# EAGLE design RevisedCape (EAGLE 7.2.0)
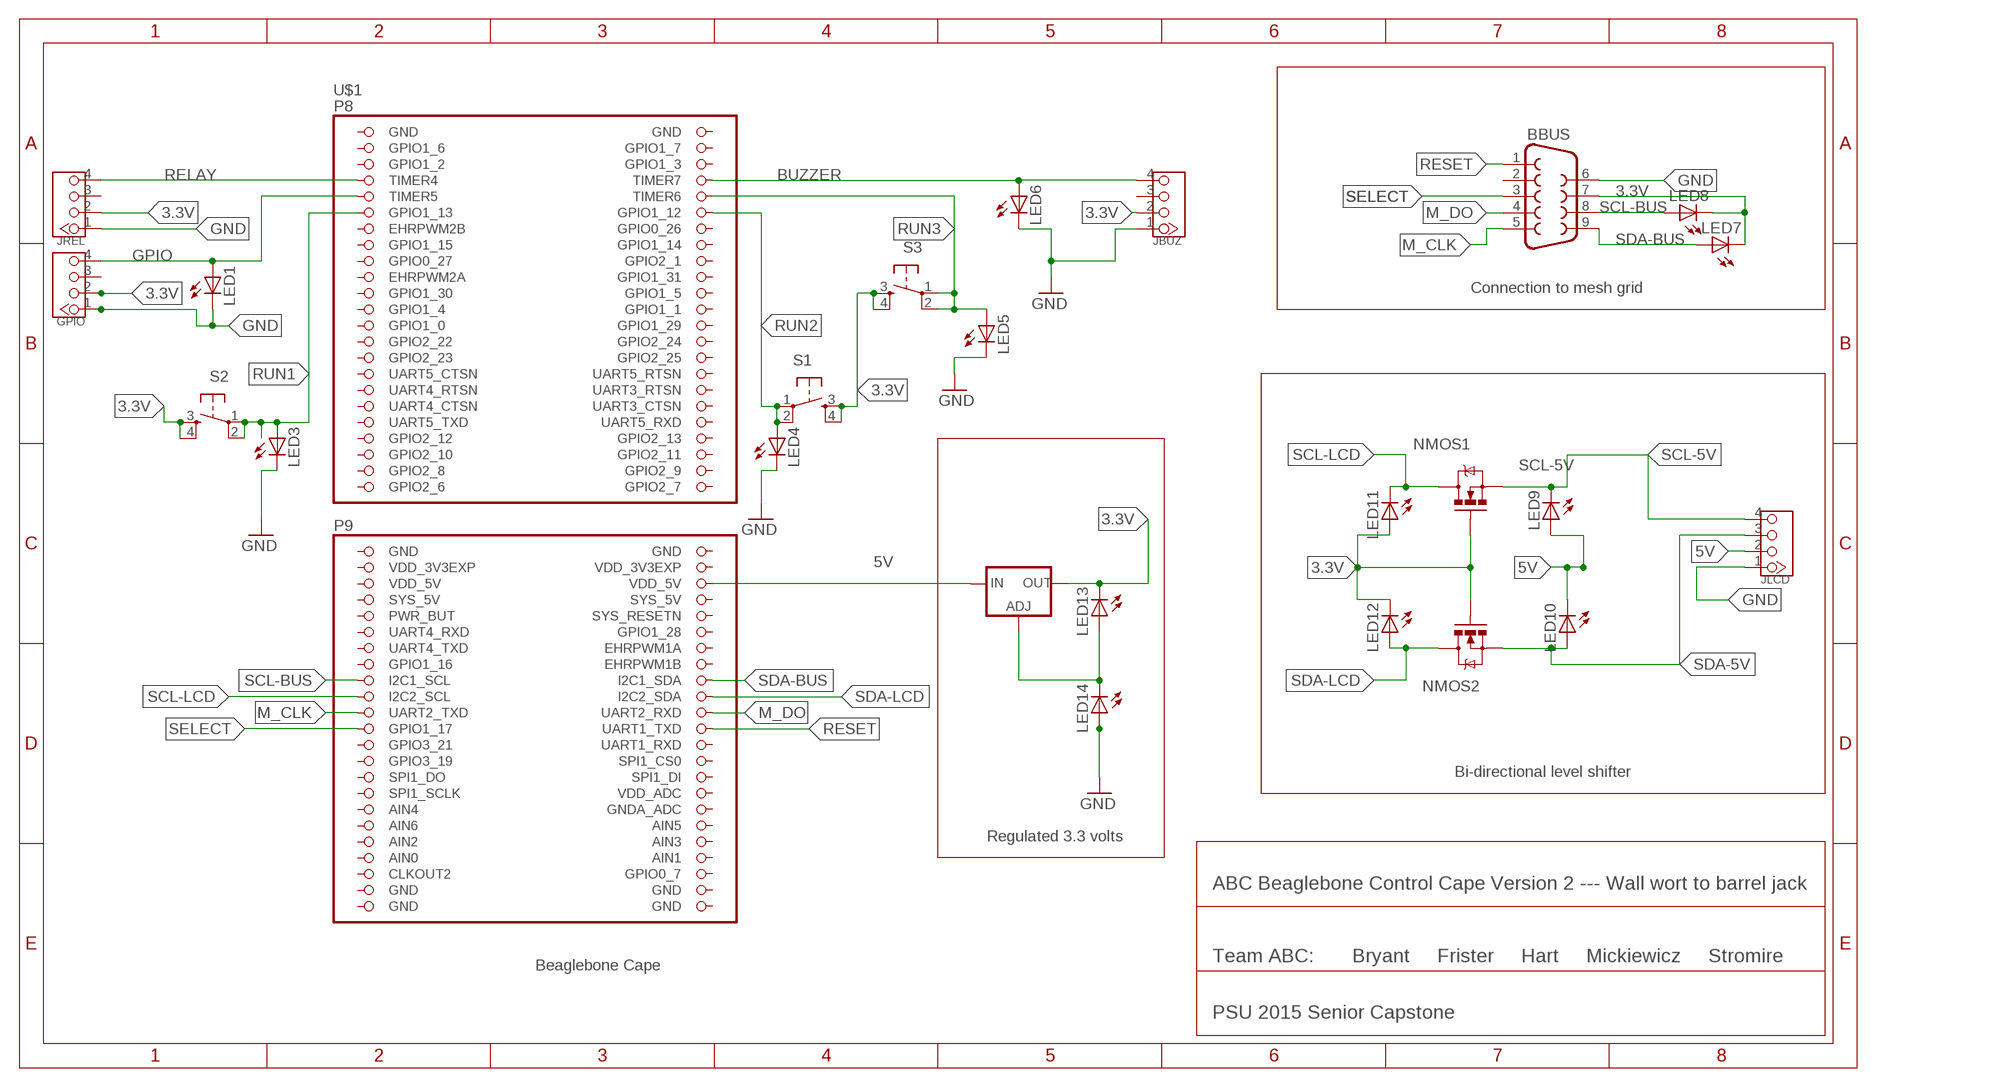
[diagram p0: schematic, sheet 1]

## Parts
3.3VREG  V_REG_317SINK  [TO220-ADJ]
BBUS  F09H  [F09H]
GPIO  TWIG-4P-2.0-2.0  [4P-2.0]
JBUZ  TWIG-4P-2.0-2.0  [4P-2.0]
JLCD  TWIG-4P-2.0-2.0  [4P-2.0]
JREL  TWIG-4P-2.0-2.0  [4P-2.0]
LED1  LED3MM  [LED3MM]
LED3  LED3MM  [LED3MM]
LED4  LED3MM  [LED3MM]
LED5  LED3MM  [LED3MM]
LED6  LED3MM  [LED3MM]
LED7  LED3MM  [LED3MM]
LED8  LED3MM  [LED3MM]
LED9  LED3MM  [LED3MM]
LED10  LED3MM  [LED3MM]
LED11  LED3MM  [LED3MM]
LED12  LED3MM  [LED3MM]
LED13  LED3MM  [LED3MM]
LED14  LED3MM  [LED3MM]
NMOS1  MOSFET-NCHANNEL2N7000  [TO-92]
NMOS2  MOSFET-NCHANNEL2N7000  [TO-92]
S1  TAC_SWITCHPTH  [TACTILE-PTH]
S2  TAC_SWITCHPTH  [TACTILE-PTH]
S3  TAC_SWITCHPTH  [TACTILE-PTH]
U$1  BEAGLEBONE_OUTLINE  [BEAGLEBONE_SHIELD]

## Nets
3.3V: 3.3VREG.OUT BBUS.7 GPIO.2 JBUZ.2 JREL.2 LED7.K(C) LED8.K(C) LED11.A LED12.K(C) LED13.K(C) NMOS1.2(G) NMOS2.2(G) S1.3 S1.4 S2.3 S2.4 S3.3 S3.4
5V: 3.3VREG.IN JLCD.2 LED9.A LED10.K(C) U$1.52(VDD_5V)
BUZZER: JBUZ.4 LED6.A U$1.8(TIMER7)
GND: BBUS.6 GPIO.1 JBUZ.1 JLCD.1 JREL.1 LED1.K(C) LED3.K(C) LED4.K(C) LED5.K(C) LED6.K(C) LED14.A
GPIO: GPIO.4 LED1.A U$1.9(TIMER5)
M_CLK: BBUS.5 U$1.67(UART2_TXD)
M_DO: BBUS.4 U$1.68(UART2_RXD)
REGADJ: 3.3VREG.ADJ LED13.A LED14.K(C)
RELAY: JREL.4 U$1.7(TIMER4)
RESET: BBUS.1 U$1.70(UART1_TXD)
RUN1: LED3.A S2.1 S2.2 U$1.11(GPIO1_13)
RUN2: LED4.A S1.1 S1.2 U$1.12(GPIO1_12)
RUN3: LED5.A S3.1 S3.2 U$1.10(TIMER6)
SCL-5V: JLCD.4 LED9.K(C) NMOS1.1(S)
SCL-BUS: BBUS.8 LED8.A U$1.63(I2C1_SCL)
SCL-LCD: LED11.K(C) NMOS1.3(D) U$1.65(I2C2_SCL)
SDA-5V: JLCD.3 LED10.A NMOS2.1(S)
SDA-BUS: BBUS.9 LED7.A U$1.64(I2C1_SDA)
SDA-LCD: LED12.A NMOS2.3(D) U$1.66(I2C2_SDA)
SELECT: BBUS.3 U$1.69(GPIO1_17)
Unconnected: BBUS.2 GPIO.3 JBUZ.3 JREL.3 U$1.3(GPIO1_6) U$1.4(GPIO1_7) U$1.5(GPIO1_2) U$1.6(GPIO1_3) U$1.13(EHRPWM2B) U$1.14(GPIO0_26) U$1.15(GPIO1_15) U$1.16(GPIO1_14) U$1.17(GPIO0_27) U$1.18(GPIO2_1) U$1.19(EHRPWM2A) U$1.20(GPIO1_31) U$1.21(GPIO1_30) U$1.22(GPIO1_5) U$1.23(GPIO1_4) U$1.24(GPIO1_1) U$1.25(GPIO1_0) U$1.26(GPIO1_29) U$1.27(GPIO2_22) U$1.28(GPIO2_24) U$1.29(GPIO2_23) U$1.30(GPIO2_25) U$1.31(UART5_CTSN) U$1.32(UART5_RTSN) U$1.33(UART4_RTSN) U$1.34(UART3_RTSN) U$1.35(UART4_CTSN) U$1.36(UART3_CTSN) U$1.37(UART5_TXD) U$1.38(UART5_RXD) U$1.39(GPIO2_12) U$1.40(GPIO2_13) U$1.41(GPIO2_10) U$1.42(GPIO2_11) U$1.43(GPIO2_8) U$1.44(GPIO2_9) U$1.45(GPIO2_6) U$1.46(GPIO2_7) U$1.54(SYS_5V) U$1.55(PWR_BUT) U$1.56(SYS_RESETN) U$1.57(UART4_RXD) U$1.58(GPIO1_28) U$1.59(UART4_TXD) U$1.60(EHRPWM1A) U$1.61(GPIO1_16) U$1.62(EHRPWM1B) U$1.71(GPIO3_21) U$1.72(UART1_RXD) U$1.73(GPIO3_19) U$1.74(SPI1_CS0) U$1.75(SPI1_DO) U$1.76(SPI1_DI) U$1.77(SPI1_SCLK) U$1.78(VDD_ADC) U$1.79(AIN4) U$1.80(GNDA_ADC) U$1.81(AIN6) U$1.82(AIN5) U$1.83(AIN2) U$1.84(AIN3) U$1.86(AIN1) U$1.87(CLKOUT2) U$1.88(GPIO0_7)

## Notes on the sheet
- Connection to mesh grid
- Bi-directional level shifter
- Regulated 3.3 volts
- ABC Beaglebone Control Cape | Version 2 --- Wall wort to barrel jack
- Team ABC:       Bryant     Frister     Hart     Mickiewicz     Stromire
- Beaglebone Cape
- PSU 2015 Senior Capstone

## Power pins joined to a net without a drawn wire
AIN0: U$1.85(AIN0)
GND: U$1.1(GND) U$1.2(GND) U$1.47(GND) U$1.48(GND) U$1.89(GND) U$1.90(GND) U$1.91(GND) U$1.92(GND)
SYS_5V: U$1.53(SYS_5V)
VDD_3V3EXP: U$1.49(VDD_3V3EXP) U$1.50(VDD_3V3EXP)
VDD_5V: U$1.51(VDD_5V)

## Library data of the parts
3.3VREG = SparkFun-PowerIC:V_REG_317: Voltage Regulator Standard LM317 adjustable voltage regulator. AOI (Adjust Output Input). Google 'LM317 Calculator' for easy to use app to get the two resistor values needed. 240/720 for 5V output. 240/390 for 3.3V output. Spark Fun Electronics SKU : COM-00527
BBUS = con-subd:F09: SUB-D; OC_FARNELL: unknown; OC_NEWARK: unknown
GPIO JBUZ JLCD JREL = Connector:TWIG-4P-2.0
LED1 LED3-LED14 = adafruit:LED: LED OSRAM: - CHIPLED LG R971, LG N971, LY N971, LG Q971, LY Q971, LO R971, LY R971 LH N974, LH R974 LS Q976, LO Q976, LY Q976 LO Q996 - Hyper CHIPLED LW Q18S LB Q993, LB Q99A, LB R99A - SideLED LS A670, LO A670, LY A670, LG A670, LP A670 LB A673, LV A673, LT A673, LW A673 LH A674 LY A675 LS A676, LA A676, LO A676, LY A676, LW A676 LS A679, LY A679, LG A679 - Hyper Micro SIDELED® LS Y876, LA Y876, LO Y876, LY Y876 LT Y87S - SmartLED LW L88C, LW L88S LB L89C, LB L89S, LG L890 LS L89K, LO L89K, LY L89K LS L896, LA L896, LO L896, LY L896 - TOPLED LS T670, LO T670, LY T670, LG T670, LP T670 LSG T670, LSP T670, LSY T670, LOP T670, LYG T670 LG T671, LOG T671, LSG T671 LB T673, LV T673, LT T673, LW T673 LH T674 LS T676, LA T676, LO T676, LY T676, LB T676, LH T676, LSB T676, LW T676 LB T67C, LV T67C, LT T67C, LS T67K, LO T67K, LY T67K, LW E67C LS E67B, LA E67B, LO E67B, LY E67B, LB E67C, LV E67C, LT E67C LW T67C LS T679, LY T679, LG T679 LS T770, LO T770, LY T770, LG T770, LP T770 LB T773, LV T773, LT T773, LW T773 LH T774 LS E675, LA E675, LY E675, LS T675 LS T776, LA T776, LO T776, LY T776, LB T776 LHGB T686 LT T68C, LB T68C - Hyper Mini TOPLED® LB M676 - Mini TOPLED Santana® LG M470 LS M47K, LO M47K, LY M47K Source: http://www.osram.convergy.de/
NMOS1 NMOS2 = SparkFun-DiscreteSemi:MOSFET-NCHANNEL: Common NMOSFET Parts MFG P/N Store ID Prod ID FDD8780 TRANS-09984 SI7820DN TRANS-11055 FDS6630A IC-08089 2N7002PW TRANS-11151 FQP30N06L COM-10213 TRANS-10060 BSS123LT1G TRANS-08345 BSS138 TRANS-00830 BS170 2N7000
S1-S3 = SparkFun-Electromechanical:TAC_SWITCH: Momentary Switch Button commonly used for reset or general input. Spark Fun Electronics SKU : COM-00097 SMT- SWCH-08247
U$1 = adafruit:BEAGLEBONE_OUTLINE: Should match A3 pinout - but not completely tested

## Board
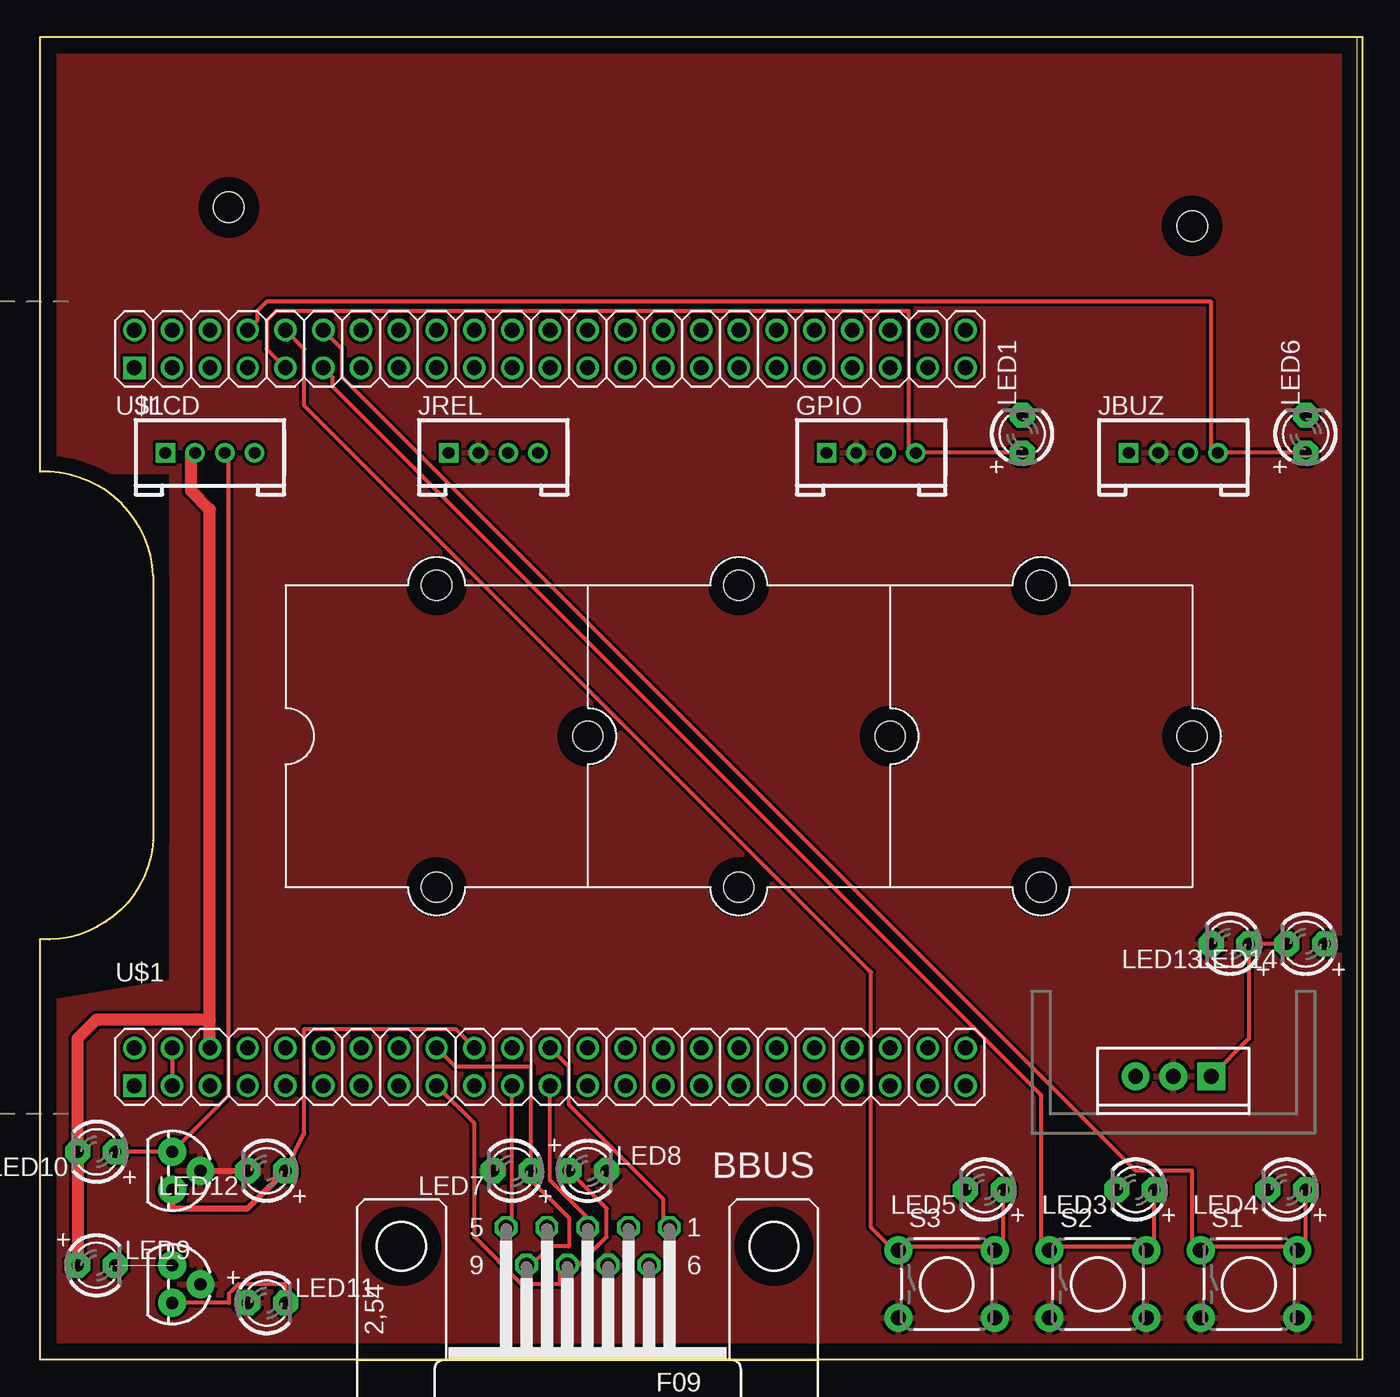
[diagram p1: board, top side]
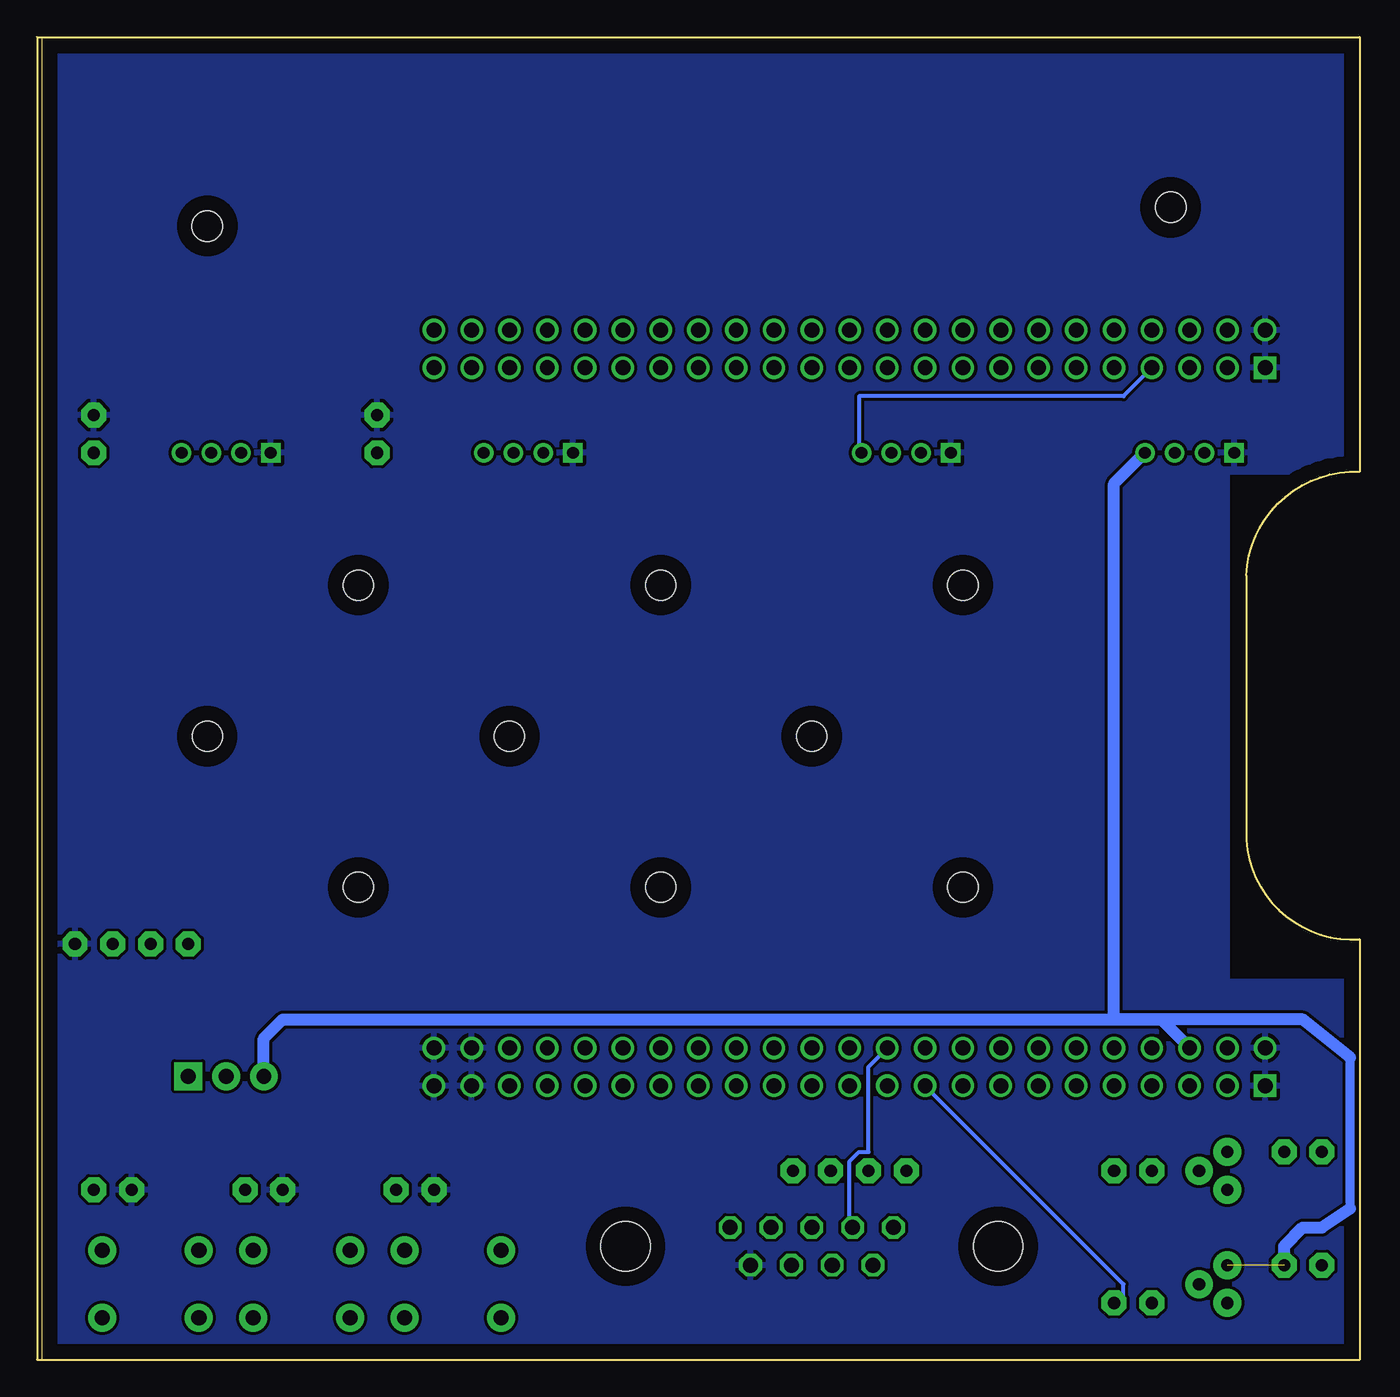
[diagram p2: board, bottom side, seen from below]

Size 88.9 x 88.9 mm. Coordinates in mm from the lower left corner, seen from the top.
Outline: 0,0 88.57,0 88.57,88.89 0,88.89
Copper layers (1*16): Top 0.035mm / dielectric 1.5mm / Bottom 0.035mm
Design rules "default": minimum track width 10mil, minimum drill 24mil, track to track 8mil, track to pad 8mil, pad to pad 8mil, via to via 8mil, smd to smd 8mil, copper to edge 40mil, drill to drill 8mil, minimum pad ring 10mil, minimum via ring 8mil, stop-mask expansion 4mil, vias tented up to drill 0mil, thermal gap 10mil
Holes 2.03 mm at 12.7,77.47 77.47,76.2

### Footprints (pad centres in the part's own frame; a part is rotated, then mirrored left to right if it is on the bottom)
TO220-ADJ = drill 1 pad 1.88 square: ADJ -2.54,0 | drill 1 pad 1.88: IN 2.54,0; OUT 0,0
F09H = drill 1.016 octagon: 1 -5.486,-1.27; 2 -2.743,-1.27; 3 0,-1.27; 4 2.743,-1.27; 5 5.486,-1.27; 6 -4.115,1.27; 7 -1.372,1.27; 8 1.372,1.27; 9 4.115,1.27 | hole 3.302: -12.522,0; 12.522,0
4P-2.0 = drill 0.8 pad 1.27 square: 1 -3,0 | drill 0.8 pad 1.27: 2 -1,0; 3 1,0; 4 3,0
LED3MM = drill 0.813 pad 1.676 octagon: A -1.27,0; K 1.27,0
TO-92 = drill 0.813 pad 1.88: 1 -1.27,0; 2 0,1.905; 3 1.27,0
TACTILE-PTH = drill 1.016 pad 1.88: 1 -3.251,2.261; 2 3.251,2.261; 3 -3.251,-2.261; 4 3.251,-2.261
BEAGLEBONE_SHIELD = drill 1 square: 1 6.35,66.675; 47 6.35,18.415 | drill 1: 2 6.35,69.215; 3 8.89,66.675; 4 8.89,69.215; 5 11.43,66.675; 6 11.43,69.215; 7 13.97,66.675; 8 13.97,69.215; 9 16.51,66.675; 10 16.51,69.215; 11 19.05,66.675; 12 19.05,69.215; 13 21.59,66.675; 14 21.59,69.215; 15 24.13,66.675; 16 24.13,69.215; 17 26.67,66.675; 18 26.67,69.215; 19 29.21,66.675; 20 29.21,69.215; 21 31.75,66.675; 22 31.75,69.215; 23 34.29,66.675; 24 34.29,69.215; 25 36.83,66.675; 26 36.83,69.215; 27 39.37,66.675; 28 39.37,69.215; 29 41.91,66.675; 30 41.91,69.215; 31 44.45,66.675; 32 44.45,69.215; 33 46.99,66.675; 34 46.99,69.215; 35 49.53,66.675; 36 49.53,69.215; 37 52.07,66.675; 38 52.07,69.215; 39 54.61,66.675; 40 54.61,69.215; 41 57.15,66.675; 42 57.15,69.215; 43 59.69,66.675; 44 59.69,69.215; 45 62.23,66.675; 46 62.23,69.215; 48 6.35,20.955; 49 8.89,18.415; 50 8.89,20.955; 51 11.43,18.415; 52 11.43,20.955; 53 13.97,18.415; 54 13.97,20.955; 55 16.51,18.415; 56 16.51,20.955; 57 19.05,18.415; 58 19.05,20.955; 59 21.59,18.415; 60 21.59,20.955; 61 24.13,18.415; 62 24.13,20.955; 63 26.67,18.415; 64 26.67,20.955; 65 29.21,18.415; 66 29.21,20.955; 67 31.75,18.415; 68 31.75,20.955; 69 34.29,18.415; 70 34.29,20.955; 71 36.83,18.415; 72 36.83,20.955; 73 39.37,18.415; 74 39.37,20.955; 75 41.91,18.415; 76 41.91,20.955; 77 44.45,18.415; 78 44.45,20.955; 79 46.99,18.415; 80 46.99,20.955; 81 49.53,18.415; 82 49.53,20.955; 83 52.07,18.415; 84 52.07,20.955; 85 54.61,18.415; 86 54.61,20.955; 87 57.15,18.415; 88 57.15,20.955; 89 59.69,18.415; 90 59.69,20.955; 91 62.23,18.415; 92 62.23,20.955
SEEED = hole 2.019: 10.16,0; 10.16,20.32; 20.32,10.16

### Placement (x,y rotation side)
3.3VREG  76.2,19.05 180 top
BBUS  36.83,7.62 180 top
GPIO  55.88,60.96 0 top
JBUZ  76.2,60.96 0 top
JLCD  11.43,60.96 0 top
JREL  30.48,60.96 0 top
LED1  66.04,62.23 90 top
LED3  73.66,11.43 180 top
LED4  83.82,11.43 180 top
LED5  63.5,11.43 180 top
LED6  85.09,62.23 90 top
LED7  31.75,12.7 180 top
LED8  36.83,12.7 0 top
LED9  3.81,6.35 0 top
LED10  3.81,13.97 180 top
LED11  15.24,3.81 0 top
LED12  15.24,12.7 180 top
LED13  80.01,27.94 180 top
LED14  85.09,27.94 180 top
NMOS1  8.89,5.08 270 top
NMOS2  8.89,12.7 270 top
S1  81.28,5.08 0 top
S2  71.12,5.08 0 top
S3  60.96,5.08 0 top
U$1  0,0 0 top
U$2  [SEEED]  57.15,31.75 0 top
U$3  [SEEED]  36.83,31.75 0 top
U$4  [SEEED]  16.51,31.75 0 top

### Tracks (layer width: path | path; a pad name or v marks a point on that pad's centre or on a via)
3.3V
  Top 0.406: NMOS2.2 LED12.K
  pour Top: 1.27,87.63 87.63,87.63 87.63,1.27 1.27,0 1.27,24.13 8.89,25.4 8.89,59.69 1.27,59.69
5V
  Top 0.813: U$1.52 11.43,22.86 | 11.43,22.86 11.43,57.15 10.16,58.42 10.16,60.69 JLCD.2 | LED9.A LED10.K 2.54,21.59 3.81,22.86 11.43,22.86
  Bottom 0.813: 3.3VREG.IN 73.66,21.59 72.39,22.86 13.34,22.86 U$1.52
BUZZER
  Top 0.254: LED6.A JBUZ.4 78.74,60.96 78.74,71.12 15.24,71.12 14.61,70.48 14.61,69.85 U$1.8
GND
  pour Bottom: 0,88.9 87.63,88.9 87.63,0 0,0 0,25.4 8.89,25.4 8.89,59.69 0,59.69
GPIO
  Top 0.254: LED1.A GPIO.4 58.42,60.96 58.42,70.48 15.88,70.48 15.24,69.85 15.24,67.94 U$1.9
M_CLK
  Top 0.254: U$1.67 31.75,8.89 BBUS.5
M_DO
  Bottom 0.254: U$1.68 33.02,19.68 33.02,13.97 33.66,13.97 34.29,13.34 34.29,8.89 BBUS.4
REGADJ
  Top 0.254: LED14.K LED13.A 81.28,21.59 3.3VREG.ADJ
RELAY
  Bottom 0.254: U$1.7 15.88,64.77 33.66,64.77 33.66,60.96 JREL.4
RESET
  Top 0.254: U$1.70 35.56,19.68 35.56,17.14 41.91,10.79 41.91,8.89 BBUS.1
RUN1
  Top 0.254: LED3.A 74.93,7.62 S2.2 74.3,7.62 67.94,7.62 S2.1 67.31,7.62 67.31,17.78 19.68,65.41 19.68,66.04 U$1.11
RUN2
  Top 0.254: LED4.A 85.09,7.62 S1.2 84.45,7.62 78.11,7.62 S1.1 77.47,7.62 77.47,12.7 73.66,12.7 20.32,66.04 20.32,67.94 U$1.12
RUN3
  Top 0.254: LED5.A 64.77,7.62 S3.2 64.14,7.62 57.78,7.62 S3.1 57.15,7.62 55.88,8.89 55.88,26.04 17.78,64.14 17.78,67.94 U$1.10
SCL-5V  (1 unrouted)
  Bottom 0.61: 0.64,10.16 0.64,20.32
  Bottom 0.813: LED9.K 5.08,7.62 3.81,8.89 2.54,8.89 0.64,10.16 | 0.64,20.32 3.81,22.86 16.51,22.86 16.51,58.88 JLCD.4
SCL-BUS
  Top 0.254: U$1.63 29.21,15.88 29.21,8.26 32.38,5.08 34.92,5.08 | 34.92,5.08 34.92,6.35 BBUS.8 | LED8.A 38.1,10.16 38.1,8.26 34.92,5.08
SCL-LCD
  Top 0.254: NMOS1.3 12.7,3.81 12.7,4.45 13.34,5.08 16.51,5.08 LED11.K
  Bottom 0.254: U$1.65 15.88,5.08 15.88,3.81 LED11.K
SDA-5V
  Top 0.254: JLCD.3 12.7,60.96 12.7,17.78 NMOS2.1 LED10.A
SDA-BUS
  Top 0.254: U$1.64 27.94,19.68 33.02,19.68 LED7.A 33.02,12.06 35.56,9.53 35.56,7.62 34.29,7.62 33.02,6.35 BBUS.9
SDA-LCD
  Top 0.254: U$1.66 27.94,22.23 17.78,22.23 17.78,15.24 LED12.A
  Top 0.406: NMOS2.3 8.89,10.16 13.97,10.16 LED12.A
SELECT
  Top 0.254: U$1.69 34.29,12.06 36.83,9.53 BBUS.3
VDD_3V3EXP
  Top 0.254: U$1.50 U$1.49